# Altium project lora_tracker_altium.PrjPcb
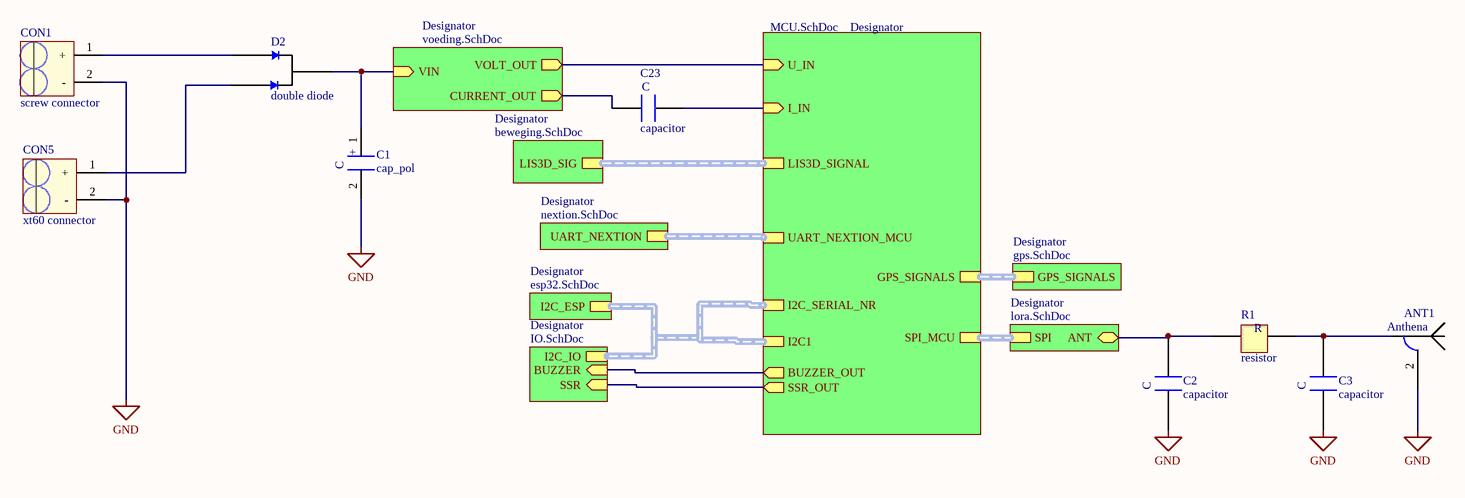
[diagram p0: top.SchDoc]
10 sheets, 76 parts. Net scope: hierarchical (ports join the sheet entries above them; power ports are global).
Board file: PCB1.PcbDoc
Sheets:
  top.SchDoc
    Designator = voeding.SchDoc
      Designator = DC_DC Convertor.SchDoc
    Designator = beweging.SchDoc
    Designator = IO.SchDoc
    Designator = gps.SchDoc
    Designator = esp32.SchDoc
    Designator = lora.SchDoc
    Designator = nextion.SchDoc
    Designator = MCU.SchDoc

## Sheet top.SchDoc
size A4; Author: Ben De Lathouwer; CompanyName: Eurocircuits; DrawnBy: Ben De Lathouwer; SheetNumber: 1; SheetTotal: 10

### Parts
ANT1  Anthena  [sma connector]
C1  cap_pol  [1206]
C2  capacitor  [0603]
C3  capacitor  [0603]
C23  capacitor  [0603]
CON1  screw connector  [SCREW connector 5mm pitch]
CON5  xt60 connector
D2  double diode  [TO-263AB]
R1  resistor  [0603]

### Sub-sheets
Designator = voeding.SchDoc: VIN (in), VOLT_OUT (out), CURRENT_OUT (out)
Designator = beweging.SchDoc: LIS3D_SIG (harness LIS3D_SIGNAL)
Designator = IO.SchDoc: SSR (in), BUZZER (in), I2C_IO (harness I2C_SERIAL_NR)
Designator = gps.SchDoc: GPS_SIGNALS (harness GPS_SIGNALS)
Designator = esp32.SchDoc: I2C_ESP (harness I2C1)
Designator = lora.SchDoc: ANT (bidir), SPI (harness SPI)
Designator = nextion.SchDoc: UART_NEXTION (harness UART_NEXTION)
Designator = MCU.SchDoc: GPS_SIGNALS (harness GPS_SIGNALS), LIS3D_SIGNAL (harness LIS3D_SIGNAL), I2C_SERIAL_NR (harness I2C_SERIAL_NR), I2C1 (harness I2C1), SPI_MCU (harness SPI), UART_NEXTION_MCU (harness UART_NEXTION), I_IN (in), U_IN (in), SSR_OUT (out), BUZZER_OUT (out)

### Nets
GND: ANT1.2 C1.2 C2.2 C3.2 CON1.2(-) CON5.2(-)
NetANT1_1: ANT1.1 C3.1 R1.1
NetC1_1: C1.1 D2.3 ; sheet Designator/VIN
NetC2_1: C2.1 R1.2 ; sheet Designator/ANT
NetC23_1: C23.1 ; sheet Designator/I_IN
NetC23_2: C23.2 ; sheet Designator/CURRENT_OUT
NetCON1_1: CON1.1(+) D2.1
NetCON5_1: CON5.1(+) D2.2
NetQ1_1: sheet Designator/BUZZER, sheet Designator/BUZZER_OUT
NetR2_2: sheet Designator/VOLT_OUT, sheet Designator/U_IN
NetR10_2: sheet Designator/SSR, sheet Designator/SSR_OUT

### Buses and harness runs
harness sheet Designator/I2C1 = sheet Designator/I2C_ESP = sheet Designator/I2C_IO = sheet Designator/I2C_SERIAL_NR
harness sheet Designator/LIS3D_SIG = sheet Designator/LIS3D_SIGNAL
harness sheet Designator/SPI = sheet Designator/SPI_MCU
harness sheet Designator/UART_NEXTION = sheet Designator/UART_NEXTION_MCU

### Notes on the sheet
- (in symbol cap_pol) +; C
- (in symbol capacitor) C
- (in symbol resistor) R

### Library data of the parts
CON5 = screw connector

## Sheet voeding.SchDoc
size A4; SheetNumber: 2; SheetTotal: 10
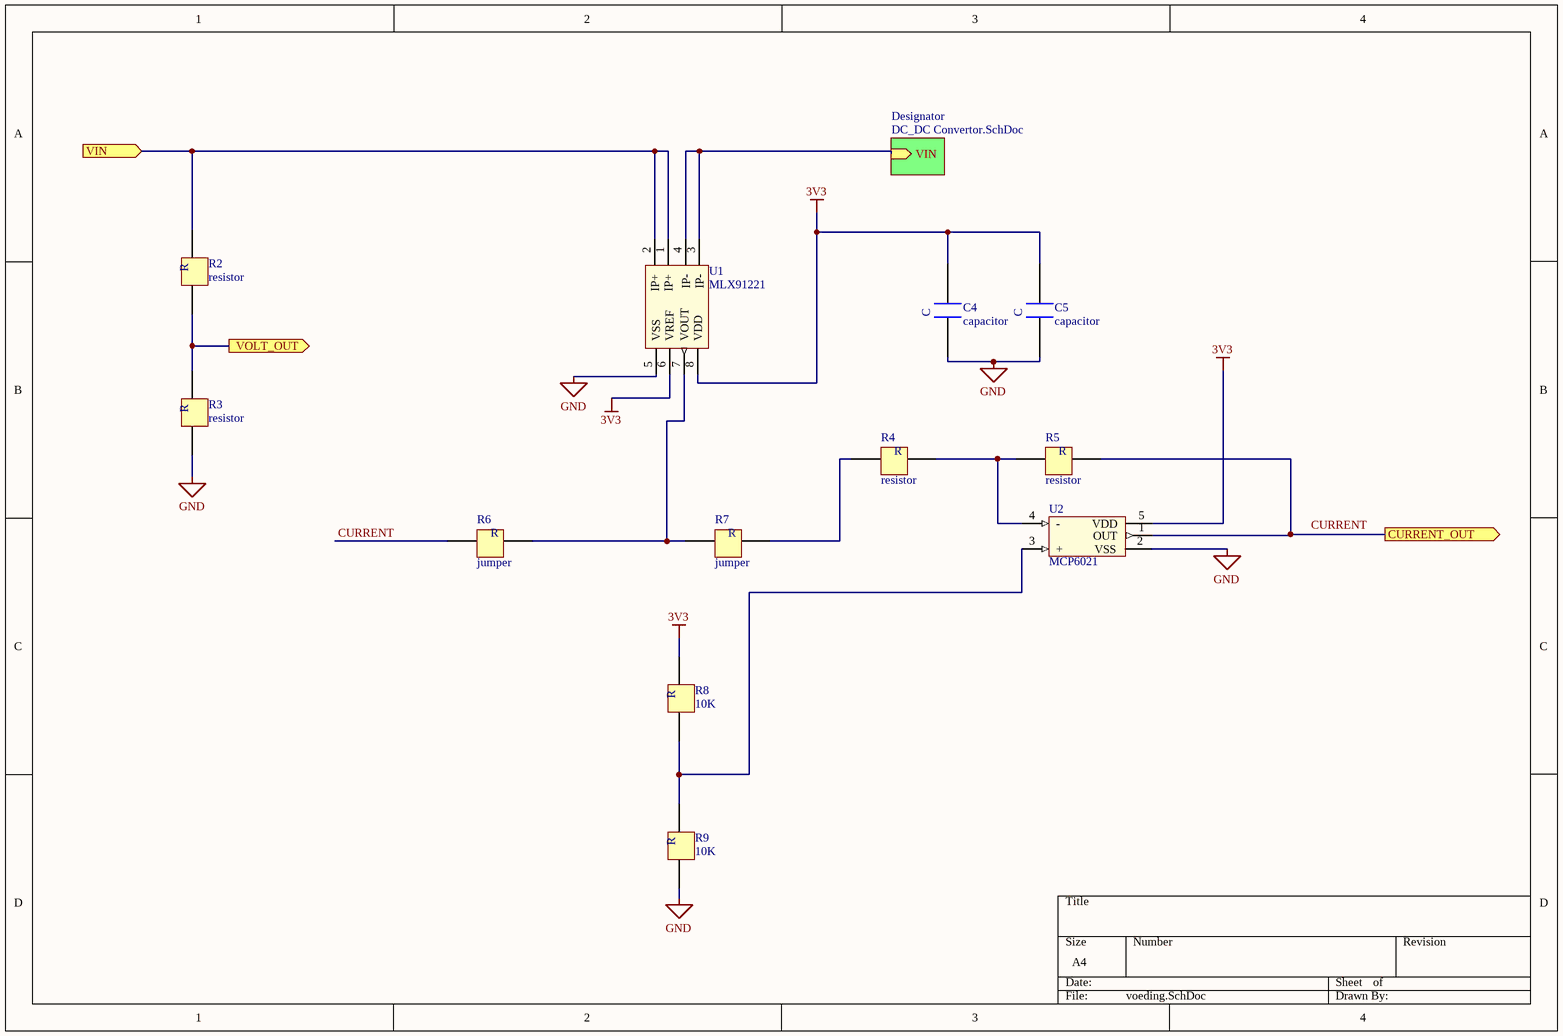
[diagram p1: voeding.SchDoc]

### Parts
C4  capacitor  [0603]
C5  capacitor  [0603]
R2  resistor  [0603]
R3  resistor  [0603]
R4  resistor  [0603]
R5  resistor  [0603]
R6  jumper  [0603]
R7  jumper  [0603]
R8  10K  [CAPC1005X04L]
R9  10K  [CAPC1005X04L]
U1  MLX91221  [SOIC8]
U2  MCP6021  [AP2112 sot25]

### Sub-sheets
Designator = DC_DC Convertor.SchDoc: VIN (in)

### Ports
CURRENT_OUT (out), VIN (in), VOLT_OUT (out)

### Nets
3V3: C4.1 C5.1 R8.1 U1.6(VREF) U1.8(VDD) U2.5(VDD)
GND: C4.2 C5.2 R3.2 R9.2 U1.5(VSS) U2.2(VSS)
CURRENT: R6.2
NetC1_1: R2.1 U1.1(IP+) U1.2(IP+) ; port VIN
NetC19_1: U1.3(IP-) U1.4(IP-) ; sheet Designator/VIN
NetC23_2: R5.1 U2.1(OUT) ; port CURRENT_OUT
NetR2_2: R2.2 R3.1 ; port VOLT_OUT
NetR4_1: R4.1 R5.2 U2.4(-)
NetR4_2: R4.2 R7.1
NetR6_1: R6.1 R7.2 U1.7(VOUT)
NetR8_2: R8.2 R9.1 U2.3(+)

### Notes on the sheet
- Labels drawn without touching a wire or pin: CURRENT
- (in symbol capacitor) C
- (in symbol resistor) R

### Library data of the parts
R6-R9 = resistor

## Sheet DC_DC Convertor.SchDoc
size A4; SheetNumber: 3; SheetTotal: 10
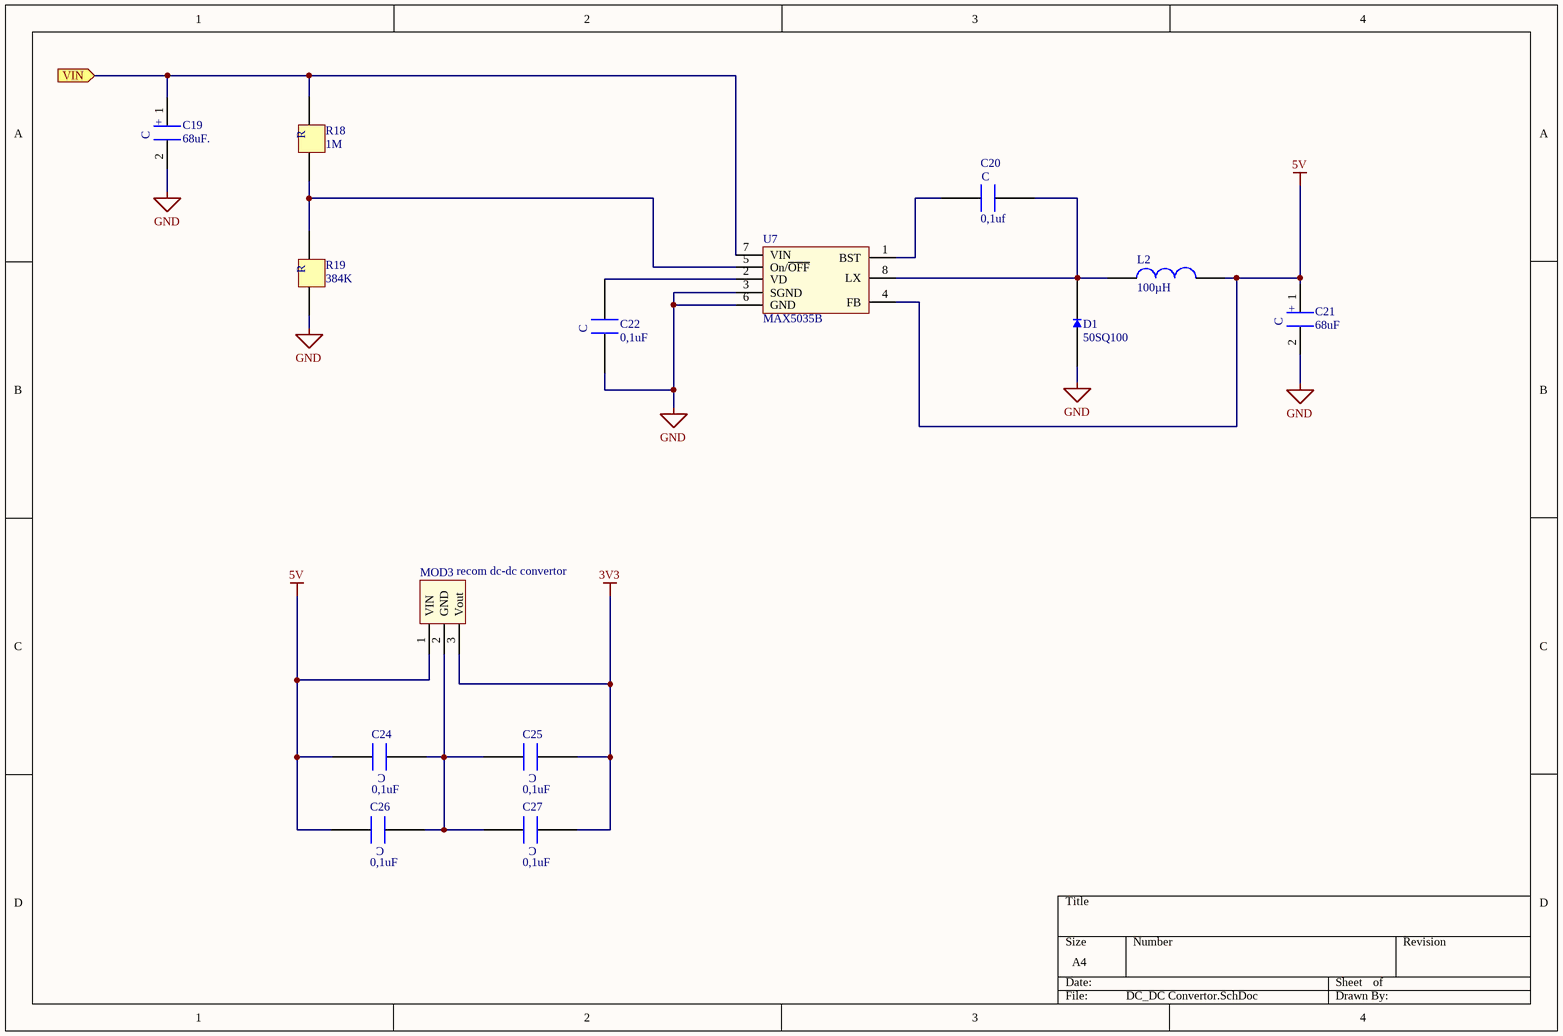
[diagram p2: DC_DC Convertor.SchDoc]

### Parts
C19  68uF.
C20  0,1uf  [CAPC1005X04L]
C21  68uF
C22  0,1uF  [CAPC1005X04L]
C24  0,1uF  [CAPC1005X04L]
C25  0,1uF  [CAPC1005X04L]
C26  0,1uF  [CAPC1005X04L]
C27  0,1uF  [CAPC1005X04L]
D1  50SQ100  [Diode]
L2  100µH  [Coilcraft , XFL4020-102]
MOD3  recom dc-dc convertor
R18  1M  [CAPC1005X04L]
R19  384K  [CAPC1005X04L]
U7  MAX5035B

### Ports
VIN (in)

### Nets
3V3: C25.2 C27.2 MOD3.3(Vout)
5V: C21.1 C24.1 C26.1 L2.1 MOD3.1(VIN) U7.4(FB)
GND: C19.2 C21.2 C22.2 D1.1 R19.2 U7.3(SGND) U7.6(GND)
NetC19_1: C19.1 R18.1 U7.7(VIN) ; port VIN
NetC20_1: C20.1 D1.2 L2.2 U7.8(LX)
NetC20_2: C20.2 U7.1(BST)
NetC22_1: C22.1 U7.2(VD)
NetC24_2: C24.2 C25.1 C26.2 C27.1 MOD3.2(GND)
NetR18_2: R18.2 R19.1 U7.5(On/~{OFF})

### Notes on the sheet
- (in symbol cap_pol) +; C
- (in symbol capacitor) C
- (in symbol resistor) R

### Library data of the parts
C19 C21 = cap_pol
C20 C22 C24-C27 = capacitor
D1 = diode
L2 = Spoel
R18 R19 = resistor
U7 = MAX5035

## Sheet beweging.SchDoc
size A4; SheetNumber: 4; SheetTotal: 10
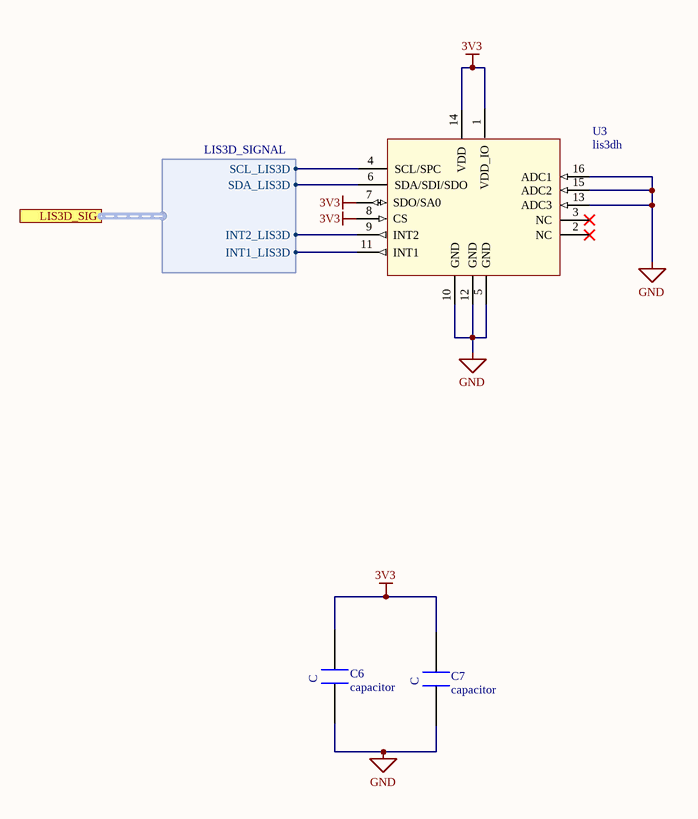
[diagram p3: beweging.SchDoc]

### Parts
C6  capacitor  [CAPC1005X04L]
C7  capacitor  [CAPC1005X04L]
U3  lis3dh

### Ports
LIS3D_SIG (harness LIS3D_SIGNAL)

### Harnesses
LIS3D_SIGNAL: SCL_LIS3D, SDA_LIS3D, INT2_LIS3D, INT1_LIS3D

### Nets
3V3: C6.1 C7.1 U3.1(VDD_IO) U3.7(SDO/SA0) U3.8(CS) U3.14(VDD)
GND: C6.2 C7.2 U3.5(GND) U3.10(GND) U3.12(GND) U3.13(ADC3) U3.15(ADC2) U3.16(ADC1)
INT2_MCU: U3.9(INT2) ; port LIS3D_SIG.INT2_LIS3D
SCL1: U3.4(SCL/SPC) ; port LIS3D_SIG.SCL_LIS3D
SDA1: U3.6(SDA/SDI/SDO) ; port LIS3D_SIG.SDA_LIS3D
NetU3_11: U3.11(INT1) ; port LIS3D_SIG.INT1_LIS3D

Not connected (* = marked no-connect by the designer): U3 2(NC)* 3(NC)*

### Notes on the sheet
- (in symbol capacitor) C

### Library data of the parts
U3 = lis3dh: low power accelerometer from st micro

## Sheet IO.SchDoc
size A4; SheetNumber: 5; SheetTotal: 10
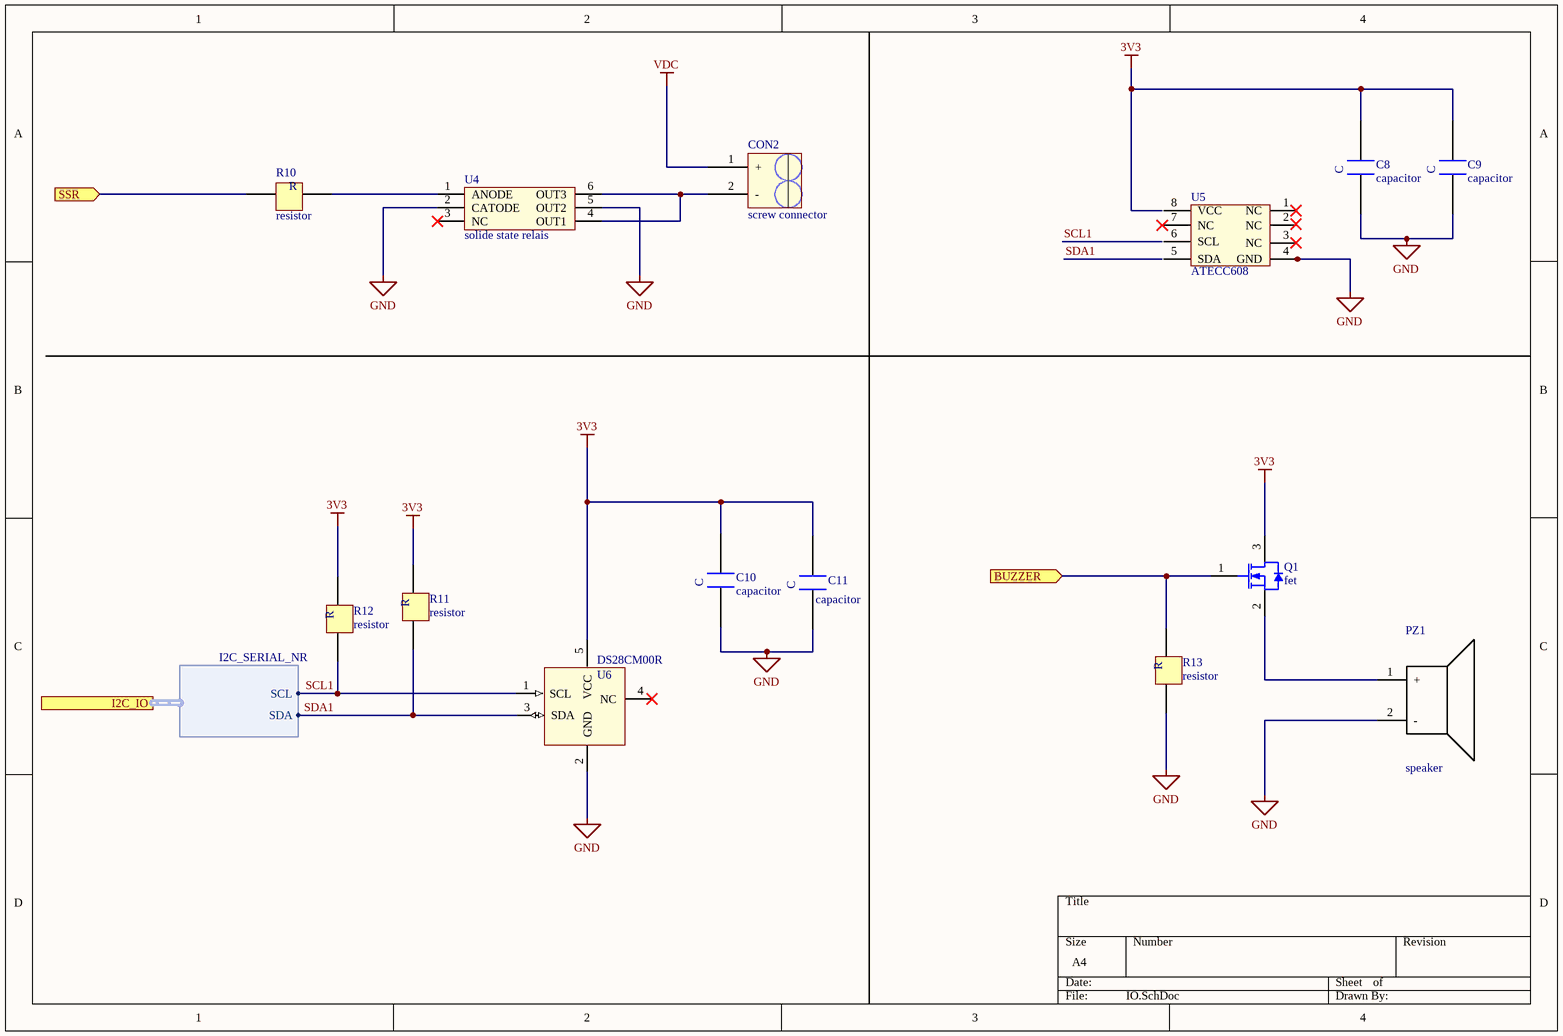
[diagram p4: IO.SchDoc]

### Parts
C8  capacitor  [CAPC1005X04L]
C9  capacitor  [CAPC1005X04L]
C10  capacitor  [CAPC1005X04L]
C11  capacitor  [CAPC1005X04L]
CON2  screw connector
PZ1  speaker
Q1  fet
R10  resistor  [CAPC1005X04L]
R11  resistor  [CAPC1005X04L]
R12  resistor  [CAPC1005X04L]
R13  resistor  [CAPC1005X04L]
U4  solide state relais
U5  ATECC608
U6  DS28CM00R

### Ports
BUZZER (in), I2C_IO (harness I2C_SERIAL_NR), SSR (in)

### Harnesses
I2C_SERIAL_NR: SCL, SDA

### Nets
3V3: C8.1 C9.1 C10.1 C11.1 Q1.3 R11.1 R12.1 U6.5(VCC)
GND: C8.2 C9.2 C10.2 C11.2 PZ1.2(-) R13.2 U4.2(CATODE) U4.5(OUT2) U5.4(GND) U6.2(GND)
VDC: CON2.1(+)
SCL1: R12.2 U6.1(SCL) ; port I2C_IO.SCL
SDA1: R11.2 U6.3(SDA) ; port I2C_IO.SDA
NetCON2_2: CON2.2(-) U4.4(OUT1) U4.6(OUT3)
NetPZ1_1: PZ1.1(+) Q1.2
NetQ1_1: Q1.1 R13.1 ; port BUZZER
NetR10_1: R10.1 U4.1(ANODE)
NetR10_2: R10.2 ; port SSR

Not connected (* = marked no-connect by the designer): U4 3(NC)*; U5 1(NC) 2(NC) 3(NC) 5(SDA) 6(SCL) 7(NC) 8(VCC); U6 4(NC)*

### Notes on the sheet
- (in symbol capacitor) C
- (in symbol resistor) R

### Library data of the parts
U4 = G3VM-61HR2(TR05)

## Sheet gps.SchDoc
size A4; SheetNumber: 6; SheetTotal: 10
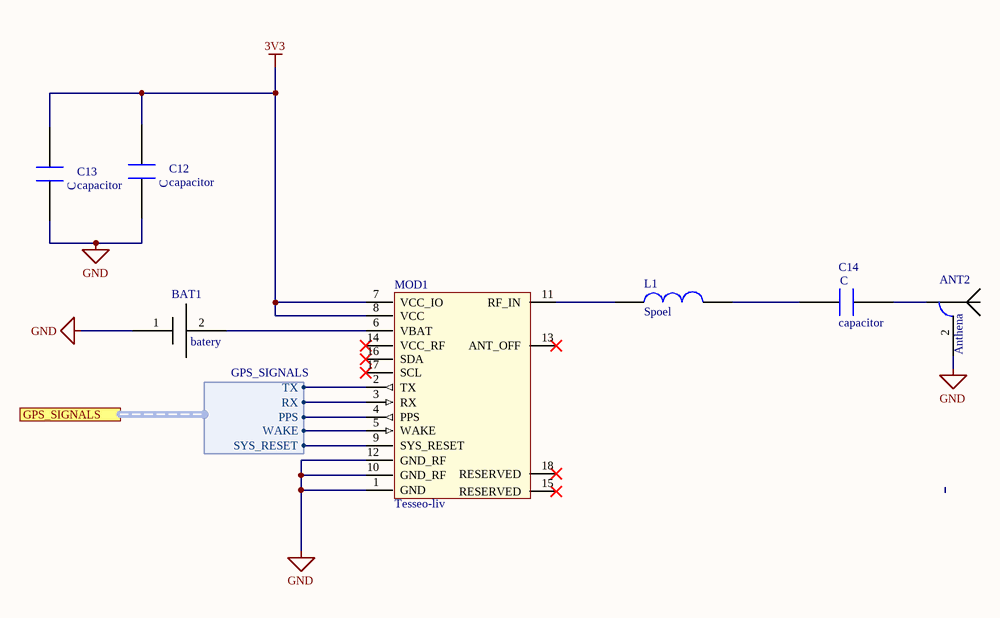
[diagram p5: gps.SchDoc]

### Parts
ANT2  Anthena
BAT1  batery
C12  capacitor  [CAPC1005X04L]
C13  capacitor  [CAPC1005X04L]
C14  capacitor  [CAPC1005X04L]
L1  Spoel  [Coilcraft , XFL4020-102]
MOD1  Tesseo-liv

### Ports
GPS_SIGNALS (harness GPS_SIGNALS)

### Harnesses
GPS_SIGNALS: TX, RX, PPS, WAKE, SYS_RESET

### Nets
3V3: C12.1 C13.1 MOD1.7(VCC_IO) MOD1.8(VCC)
GND: ANT2.2 BAT1.1 C12.2 C13.2 MOD1.1(GND) MOD1.10(GND_RF) MOD1.12(GND_RF)
PPS_GPS: MOD1.4(PPS) ; port GPS_SIGNALS.PPS
RX_GPS: MOD1.3(RX) ; port GPS_SIGNALS.RX
SYS_RST: MOD1.9(SYS_RESET) ; port GPS_SIGNALS.SYS_RESET
TX_GPS: MOD1.2(TX) ; port GPS_SIGNALS.TX
WAKE_GPS: MOD1.5(WAKE) ; port GPS_SIGNALS.WAKE
NetANT2_1: ANT2.1 C14.1
NetBAT1_2: BAT1.2 MOD1.6(VBAT)
NetC14_2: C14.2 L1.1
NetL1_2: L1.2 MOD1.11(RF_IN)

Not connected (* = marked no-connect by the designer): MOD1 13(ANT_OFF)* 14(VCC_RF)* 15(RESERVED)* 16(SDA)* 17(SCL)* 18(RESERVED)*

### Notes on the sheet
- (in symbol capacitor) C

## Sheet esp32.SchDoc
size A4; SheetNumber: 7; SheetTotal: 10
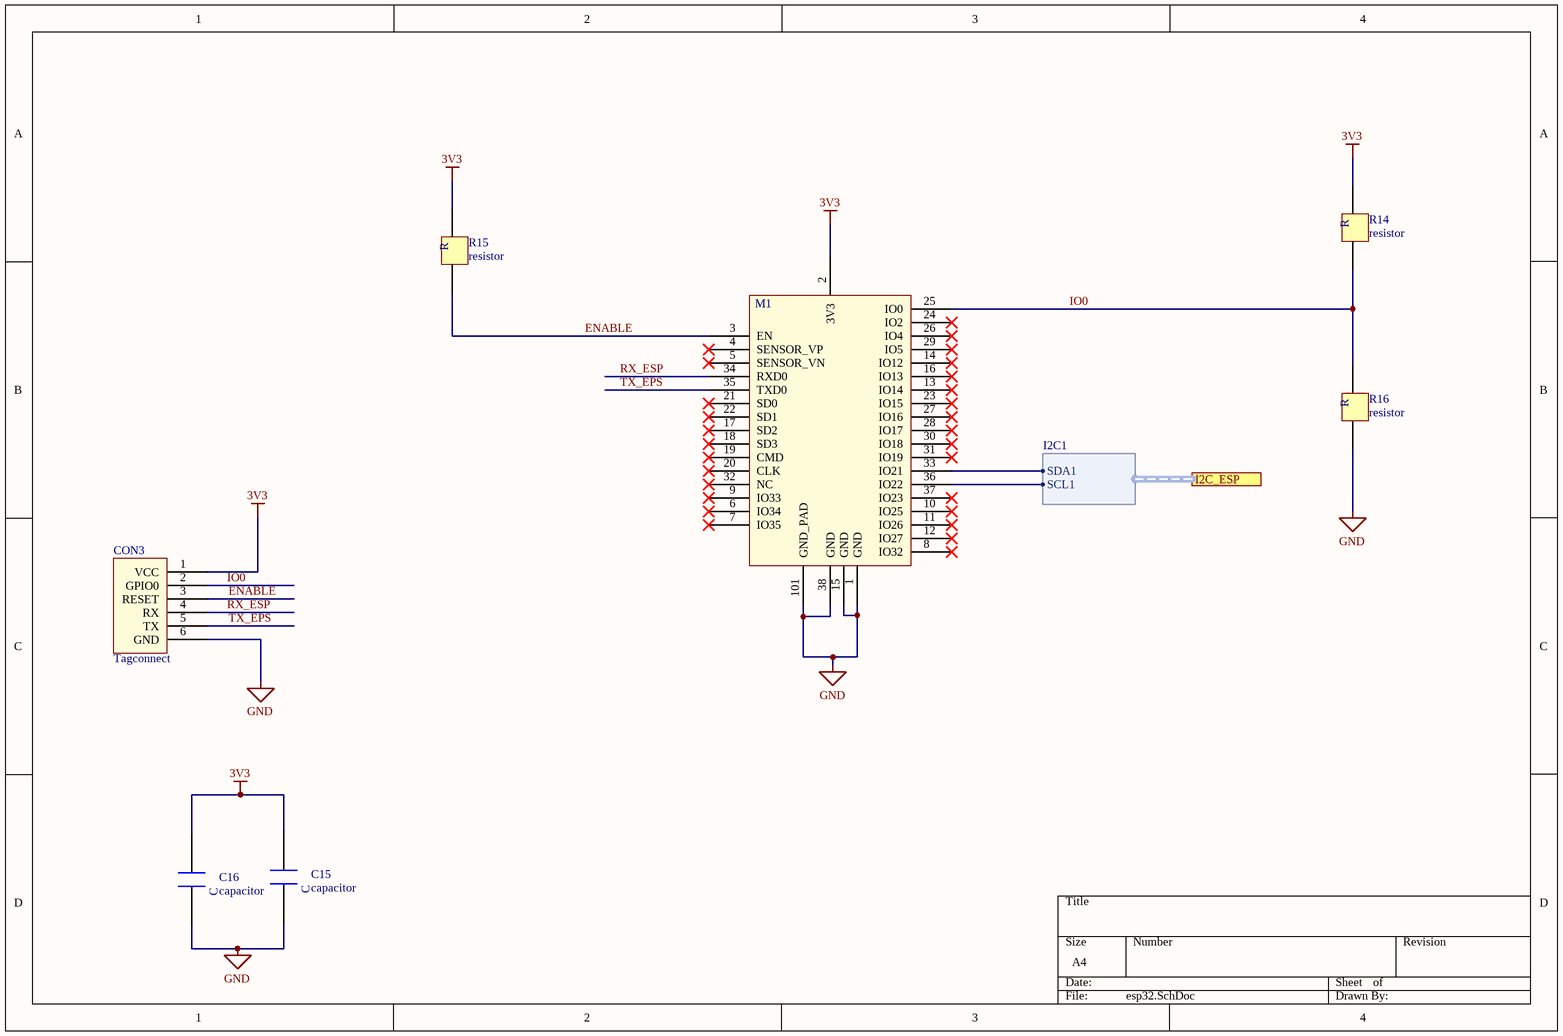
[diagram p6: esp32.SchDoc]

### Parts
C15  capacitor  [CAPC1005X04L]
C16  capacitor  [CAPC1005X04L]
CON3  Tagconnect  [Tagconnect]
M1  ESP32S_Module  [ESP32S]  (value not drawn)
R14  resistor  [CAPC1005X04L]
R15  resistor  [CAPC1005X04L]
R16  resistor  [CAPC1005X04L]

### Ports
I2C_ESP (harness I2C1)

### Harnesses
I2C1: SDA1, SCL1

### Nets
3V3: C15.1 C16.1 CON3.1(VCC) M1.2(3V3) R14.1 R15.1
GND: C15.2 C16.2 CON3.6(GND) M1.1(GND) M1.15(GND) M1.38(GND) M1.101(GND_PAD) R16.2
ENABLE: CON3.3(RESET) M1.3(EN) R15.2
IO0: CON3.2(GPIO0) M1.25(IO0) R14.2 R16.1
RX_ESP: CON3.4(RX) M1.34(RXD0)
SCL1: M1.36(IO22) ; port I2C_ESP.SCL1
SDA1: M1.33(IO21) ; port I2C_ESP.SDA1
TX_EPS: CON3.5(TX) M1.35(TXD0)

Not connected (* = marked no-connect by the designer): M1 4(SENSOR_VP)* 5(SENSOR_VN)* 6(IO34)* 7(IO35)* 8(IO32)* 9(IO33)* 10(IO25)* 11(IO26)* 12(IO27)* 13(IO14)* 14(IO12)* 16(IO13)* 17(SD2)* 18(SD3)* 19(CMD)* 20(CLK)* 21(SD0)* 22(SD1)* 23(IO15)* 24(IO2)* 26(IO4)* 27(IO16)* 28(IO17)* 29(IO5)* 30(IO18)* 31(IO19)* 32(NC)* 37(IO23)*

### Notes on the sheet
- (in symbol capacitor) C
- (in symbol resistor) R

### Library data of the parts
M1 = ESP32S_Module: Esp-32S; Datasheet: https://espressif.com/sites/default/files/documentation/esp_wroom_32_datasheet_en.pdf

## Sheet lora.SchDoc
size A4; SheetNumber: 8; SheetTotal: 10
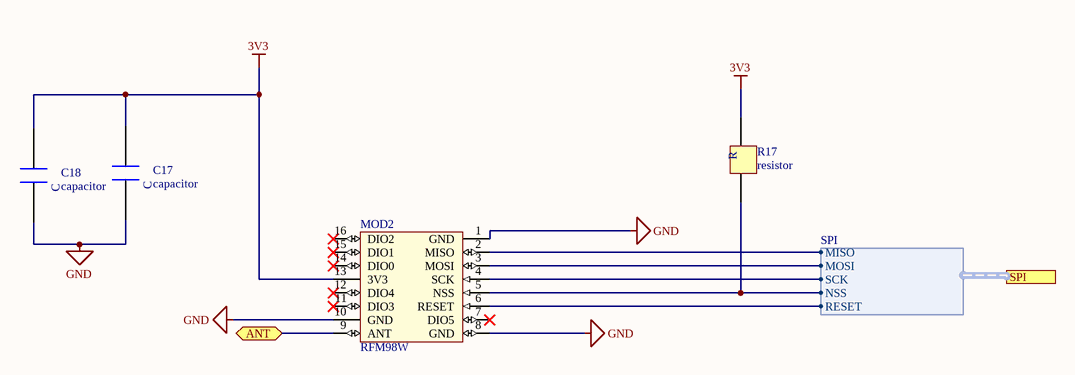
[diagram p7: lora.SchDoc]

### Parts
C17  capacitor  [CAPC1005X04L]
C18  capacitor  [CAPC1005X04L]
MOD2  RFM98W
R17  resistor  [CAPC1005X04L]

### Ports
ANT (bidir), SPI (harness SPI)

### Harnesses
SPI: MISO, MOSI, SCK, NSS, RESET

### Nets
3V3: C17.1 C18.1 MOD2.13(3V3) R17.1
GND: C17.2 C18.2 MOD2.1(GND) MOD2.8(GND) MOD2.10(GND)
MISO_MCU: MOD2.2(MISO) ; port SPI.MISO
MOSI_MCU: MOD2.3(MOSI) ; port SPI.MOSI
NSS_MCU: MOD2.5(NSS) R17.2 ; port SPI.NSS
RESET_MCU: MOD2.6(RESET) ; port SPI.RESET
SCK_MCU: MOD2.4(SCK) ; port SPI.SCK
NetC2_1: MOD2.9(ANT) ; port ANT

Not connected (* = marked no-connect by the designer): MOD2 7(DIO5)* 11(DIO3)* 12(DIO4)* 14(DIO0)* 15(DIO1)* 16(DIO2)*

### Notes on the sheet
- (in symbol capacitor) C
- (in symbol resistor) R

## Sheet nextion.SchDoc
size A4; SheetNumber: 9; SheetTotal: 10
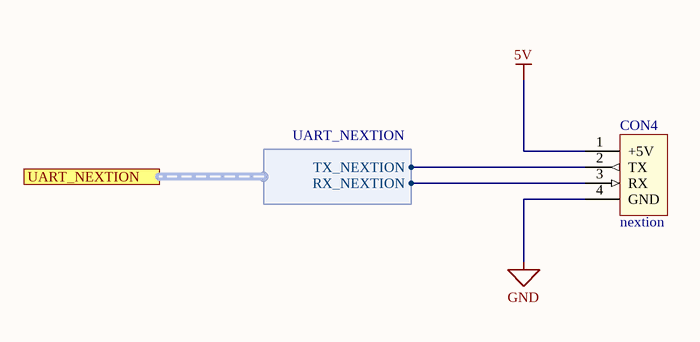
[diagram p8: nextion.SchDoc]

### Parts
CON4  nextion

### Ports
UART_NEXTION (harness UART_NEXTION)

### Harnesses
UART_NEXTION: TX_NEXTION, RX_NEXTION

### Nets
5V: CON4.1(+5V)
GND: CON4.4(GND)
NetCON4_2: CON4.2(TX) ; port UART_NEXTION.TX_NEXTION
NetCON4_3: CON4.3(RX) ; port UART_NEXTION.RX_NEXTION

## Sheet MCU.SchDoc
size A4; SheetNumber: 10; SheetTotal: 10
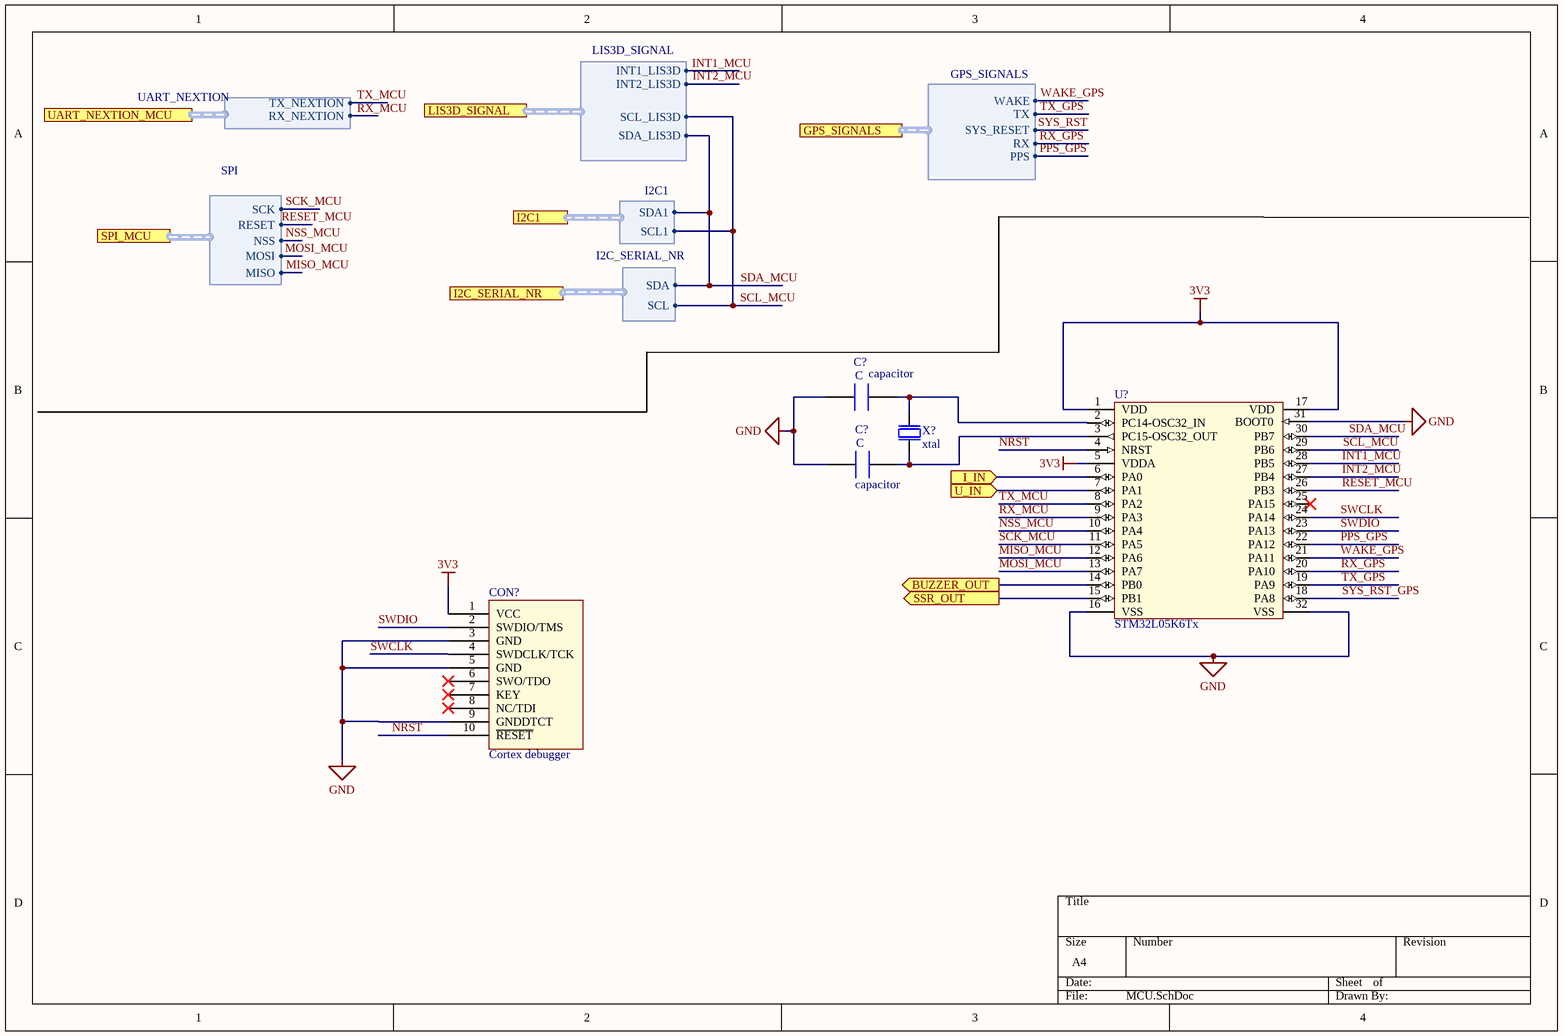
[diagram p9: MCU.SchDoc]

### Parts
(Parts that share a designator on the sheet are numbered #1, #2 ... from top to bottom, then left to right.)
C?#1  capacitor  [CAPC1005X04L]
C?#2  capacitor  [CAPC1005X04L]
CON?  Cortex debugger  [Jtag header]
U?  STM32L05K6Tx
X?  xtal  [BT-XTAL_2016]

### Ports
BUZZER_OUT (out), GPS_SIGNALS (harness GPS_SIGNALS), I2C1 (harness I2C1), I2C_SERIAL_NR (harness I2C_SERIAL_NR), I_IN (in), LIS3D_SIGNAL (harness LIS3D_SIGNAL), SPI_MCU (harness SPI), SSR_OUT (out), U_IN (in), UART_NEXTION_MCU (harness UART_NEXTION)

### Harnesses
UART_NEXTION: RX_NEXTION, TX_NEXTION
SPI: MISO, MOSI, NSS, RESET, SCK
LIS3D_SIGNAL: INT1_LIS3D, INT2_LIS3D, SCL_LIS3D, SDA_LIS3D
I2C1: SCL1, SDA1
I2C_SERIAL_NR: SCL, SDA
GPS_SIGNALS: PPS, RX, SYS_RESET, TX, WAKE

### Nets
3V3: CON?.1(VCC) U?.1(VDD) U?.5(VDDA) U?.17(VDD)
GND: C?#1.2 C?#2.2 CON?.3(GND) CON?.5(GND) CON?.9(GNDDTCT) U?.16(VSS) U?.31(BOOT0) U?.32(VSS)
INT1_MCU: U?.28(PB5)
INT2_MCU: U?.27(PB4) ; port LIS3D_SIGNAL.INT2_LIS3D
MISO_MCU: U?.12(PA6) ; port SPI_MCU.MISO
MOSI_MCU: U?.13(PA7) ; port SPI_MCU.MOSI
NRST: CON?.10(~{RESET}) U?.4(NRST)
NSS_MCU: U?.10(PA4) ; port SPI_MCU.NSS
PPS_GPS: U?.22(PA12) ; port GPS_SIGNALS.PPS
RESET_MCU: U?.26(PB3) ; port SPI_MCU.RESET
RX_GPS: U?.20(PA10) ; port GPS_SIGNALS.RX
RX_MCU: U?.9(PA3) ; harness UART_NEXTION.RX_NEXTION
SCK_MCU: U?.11(PA5) ; port SPI_MCU.SCK
SCL_MCU: U?.29(PB6) ; port LIS3D_SIGNAL.SCL_LIS3D, port I2C1.SCL1, port I2C1.SCL  [project net SCL1]
SDA_MCU: U?.30(PB7) ; port LIS3D_SIGNAL.SDA_LIS3D, port I2C1.SDA1, port I2C1.SDA  [project net SDA1]
SWCLK: CON?.4(SWDCLK/TCK) U?.24(PA14)
SWDIO: CON?.2(SWDIO/TMS) U?.23(PA13)
SYS_RST_GPS: U?.18(PA8)
TX_GPS: U?.19(PA9) ; port GPS_SIGNALS.TX
TX_MCU: U?.8(PA2) ; harness UART_NEXTION.TX_NEXTION
WAKE_GPS: U?.21(PA11) ; port GPS_SIGNALS.WAKE
NetC23_1: U?.6(PA0) ; port I_IN
NetC?#1_1: C?#1.1 U?.2(PC14-OSC32_IN) X?.3(out)
NetC?#2_1: C?#2.1 U?.3(PC15-OSC32_OUT) X?.1(inp)
NetQ1_1: U?.14(PB0) ; port BUZZER_OUT
NetR2_2: U?.7(PA1) ; port U_IN
NetR10_2: U?.15(PB1) ; port SSR_OUT

Not connected (* = marked no-connect by the designer): CON? 6(SWO/TDO)* 7(KEY)* 8(NC/TDI)*; U? 25(PA15)*

### Notes on the sheet
- Labels drawn without touching a wire or pin: INT1_MCU
- (in symbol capacitor) C

## Nets that join several sheets
3V3: voeding (6 pins), DC_DC Convertor (C25.2 C27.2 MOD3.3), beweging (6 pins), IO (8 pins), gps (C12.1 C13.1 MOD1.7 MOD1.8), esp32 (6 pins), lora (C17.1 C18.1 MOD2.13 R17.1), MCU (CON?.1 U?.1 U?.5 U?.17)
5V: DC_DC Convertor (6 pins), nextion (CON4.1)
GND: top (6 pins), voeding (6 pins), DC_DC Convertor (7 pins), beweging (8 pins), IO (10 pins), gps (7 pins), esp32 (8 pins), lora (5 pins), nextion (CON4.4), MCU (8 pins)
INT2_MCU: beweging (U3.9), MCU (U?.27)
MISO_MCU: lora (MOD2.2), MCU (U?.12)
MOSI_MCU: lora (MOD2.3), MCU (U?.13)
NetC1_1: top (C1.1 D2.3), voeding (R2.1 U1.1 U1.2)
NetC2_1: top (C2.1 R1.2), lora (MOD2.9)
NetC19_1: voeding (U1.3 U1.4), DC_DC Convertor (C19.1 R18.1 U7.7)
NetC23_1: top (C23.1), MCU (U?.6)
NetC23_2: top (C23.2), voeding (R5.1 U2.1)
NetQ1_1: IO (Q1.1 R13.1), MCU (U?.14)
NetR2_2: voeding (R2.2 R3.1), MCU (U?.7)
NetR10_2: IO (R10.2), MCU (U?.15)
NSS_MCU: lora (MOD2.5 R17.2), MCU (U?.10)
PPS_GPS: gps (MOD1.4), MCU (U?.22)
RESET_MCU: lora (MOD2.6), MCU (U?.26)
RX_GPS: gps (MOD1.3), MCU (U?.20)
SCK_MCU: lora (MOD2.4), MCU (U?.11)
SCL1: beweging (U3.4), IO (R12.2 U6.1), esp32 (M1.36), MCU (U?.29)
SDA1: beweging (U3.6), IO (R11.2 U6.3), esp32 (M1.33), MCU (U?.30)
TX_GPS: gps (MOD1.2), MCU (U?.19)
WAKE_GPS: gps (MOD1.5), MCU (U?.21)